# Altium schematic sheet TOP.SchDoc: TOP.SchDoc
size A4; Organization: Altium Limited; Address1: L3, 12a Rodborough Rd; Address2: Frenchs Forest; Address3: NSW; Address4: Australia 2086
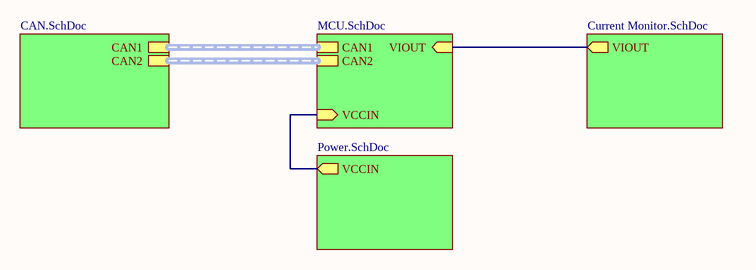
[diagram p0: TOP.SchDoc]

## Sub-sheets
CAN = CAN.SchDoc: CAN1, CAN2
Current Monitor = Current Monitor.SchDoc: VIOUT (out)
MCU = MCU.SchDoc: CAN1, CAN2, VIOUT (in), VCCIN (in)
Power = Power.SchDoc: VCCIN (out)

## Nets
(unnamed): sheet Current Monitor/VIOUT, sheet MCU/VIOUT
(unnamed): sheet MCU/VCCIN, sheet Power/VCCIN

## Buses and harness runs
harness sheet CAN/CAN1 = sheet MCU/CAN1
harness sheet CAN/CAN2 = sheet MCU/CAN2

## Notes on the sheet
- Title
- Size:
- Date:
- A4
- Number:
- Time:
- Revision:
- Sheet
- of
- File: